# Altium schematic sheet shcmeatic_sst.SchDoc
size A4; SheetNumber: 1; SheetTotal: 1
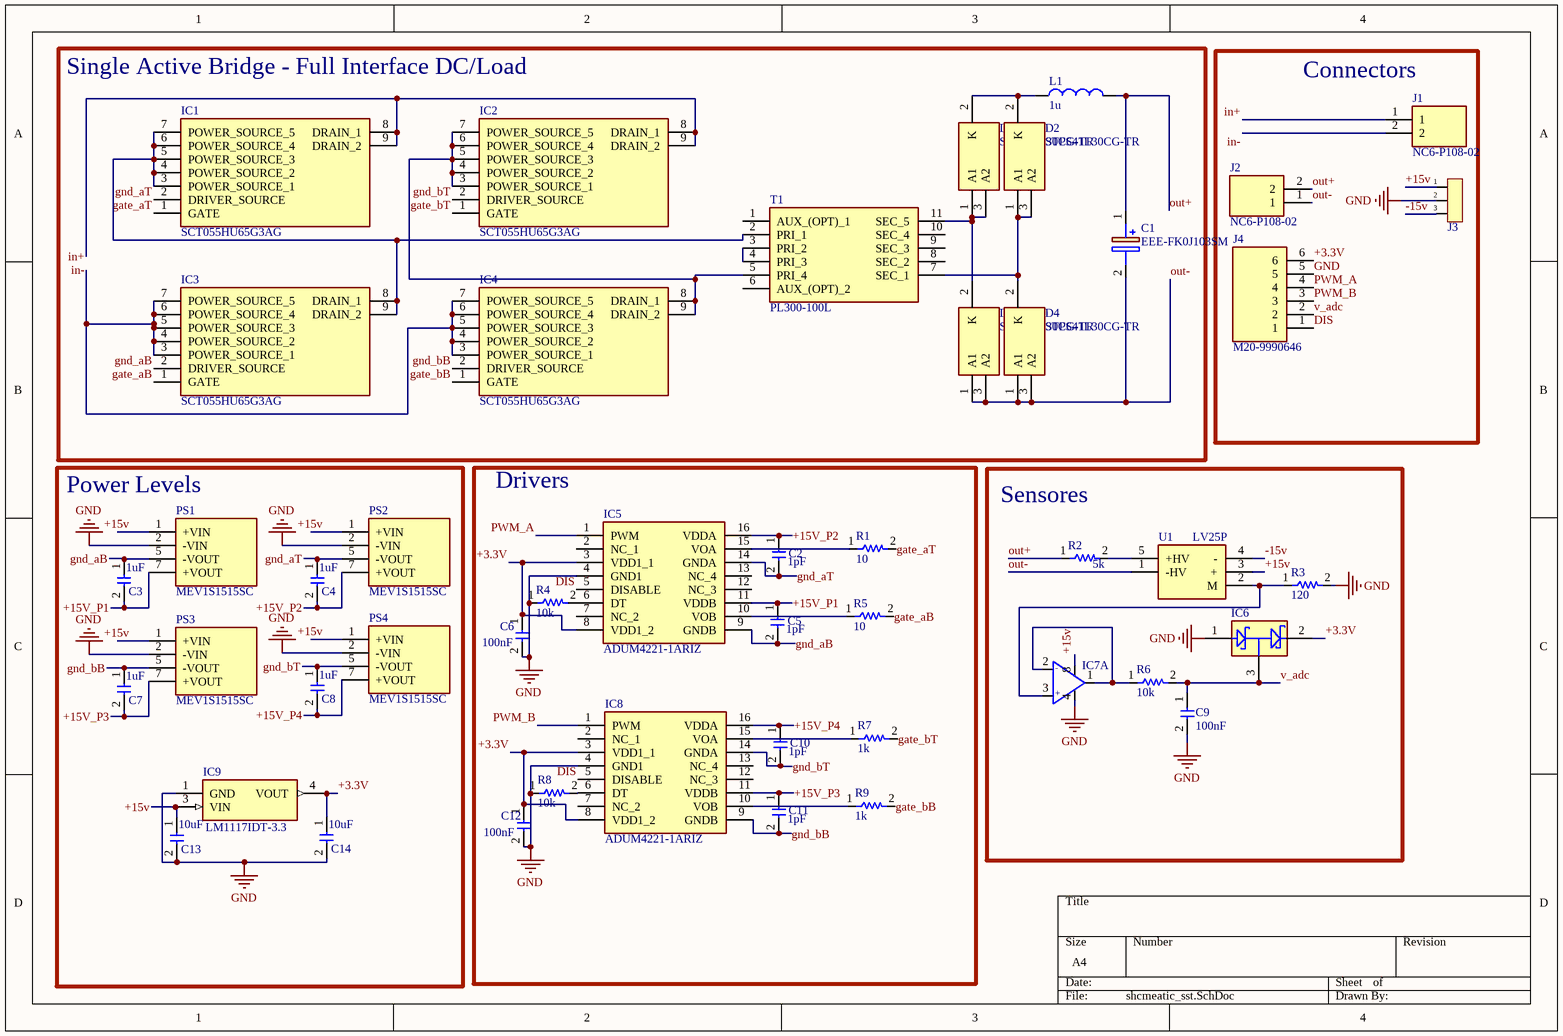
[diagram p0: shcmeatic_sst.SchDoc]

## Parts
C1  EEE-FK0J103SM  [r60_mkt_10_100_capacitor_10uF]
C2  1pF  [C1206]
C3  1uF  [C1206]
C4  1uF  [C1206]
C5  1pF  [C1206]
C6  100nF  [C1206]
C7  1uF  [C1206]
C8  1uF  [C1206]
C9  100nF  [C1206]
C10  1pF  [C1206]
C11  1pF  [C1206]
C12  100nF  [C1206]
C13  10uF  [T491C]
C14  10uF  [T491C]
D1  STPS41L30CG-TR  [STPS41L30CGTR]
D2  STPS41L30CG-TR  [STPS41L30CGTR]
D3  STPS41L30CG-TR  [STPS41L30CGTR]
D4  STPS41L30CG-TR  [STPS41L30CGTR]
IC1  SCT055HU65G3AG  [SCT055HU65G3AG]
IC2  SCT055HU65G3AG  [SCT055HU65G3AG]
IC3  SCT055HU65G3AG  [SCT055HU65G3AG]
IC4  SCT055HU65G3AG  [SCT055HU65G3AG]
IC5  ADUM4221-1ARIZ  [SOIC127P1030X264-16N]
IC6  bat54s  [BAT54S]  (value not drawn)
IC7  TSX712IDT  [SO-8]  (value not drawn)  (part A of 2)
IC8  ADUM4221-1ARIZ  [SOIC127P1030X264-16N]
IC9  LM1117IDT-3.3  [TO228P991X238-3N]
J1  NC6-P108-02  [NC6P10802]
J2  NC6-P108-02  [NC6P10802]
J3  Conector 1x3P  [Conector 1x3 Screw]  (value not drawn)
J4  M20-9990646  [HDRV6W64P0X254_1X6_1524X254X864P]
L1  value 1u  [bobine_handmade_20mm_diam]  (hidden comment: Inductor)
PS1  MEV1S1515SC  [MEV1S1515SC]
PS2  MEV1S1515SC  [MEV1S1515SC]
PS3  MEV1S1515SC  [MEV1S1515SC]
PS4  MEV1S1515SC  [MEV1S1515SC]
R1  10  [RESC3216X75N]
R2  5k  [RESC3216X75N]
R3  120  [RESC3216X75N]
R4  10k  [RESC3216X75N]
R5  10  [RESC3216X75N]
R6  10k  [RESC3216X75N]
R7  1k  [RESC3216X75N]
R8  10k  [RESC3216X75N]
R9  1k  [RESC3216X75N]
T1  PL300-100L  [PL300100L]
U1  LV25P  [LV-25-P/LV-20-P]

## Blocks framed on the sheet
Single Active Bridge - Full Interface DC/Load: C1 D1-D4 IC1-IC4 L1 T1
Connectors: J1-J4
Power Levels: C3 C4 C7 C8 C13 C14 IC9 PS1-PS4
Drivers: C2 C5 C6 C10-C12 IC5 IC8 R1 R4 R5 R7-R9
Sensores: C9 IC6 IC7 R2 R3 R6 U1

## Nets
GND: C6.2 C9.2 C12.2 C13.2 C14.2 IC5.4(GND1) IC6.1(IN) IC7.4 IC8.4(GND1) IC9.1(GND) J3.2 J4.5 PS1.2(-VIN) PS2.2(-VIN) PS3.2(-VIN) PS4.2(-VIN) R3.2 R4.1 R8.1
+3.3V: C6.1 C12.1 C14.1 IC5.3(VDD1_1) IC5.8(VDD1_2) IC6.2(OUT) IC8.3(VDD1_1) IC8.8(VDD1_2) IC9.4(VOUT) J4.6
+15v: C13.1 IC7.8 IC9.3(VIN) J3.1 PS1.1(+VIN) PS2.1(+VIN) PS3.1(+VIN) PS4.1(+VIN) U1.3(+)
+15V_P1: C3.2 C5.1 IC5.11(VDDB) PS1.7(+VOUT)
+15V_P2: C2.1 C4.2 IC5.16(VDDA) PS2.7(+VOUT)
+15V_P3: C7.2 C11.1 IC8.11(VDDB) PS3.7(+VOUT)
+15V_P4: C8.2 C10.1 IC8.16(VDDA) PS4.7(+VOUT)
-15v: J3.3 U1.4(-)
DIS: IC5.5(DISABLE) IC8.5(DISABLE) J4.1
gate_aB: IC3.1(GATE) R5.2
gate_aT: IC1.1(GATE) R1.2
gate_bB: IC4.1(GATE) R9.2
gate_bT: IC2.1(GATE) R7.2
gnd_aB: C3.1 C5.2 IC3.2(DRIVER_SOURCE) IC5.9(GNDB) PS1.5(-VOUT)
gnd_aT: C2.2 C4.1 IC1.2(DRIVER_SOURCE) IC5.14(GNDA) PS2.5(-VOUT)
gnd_bB: C7.1 C11.2 IC4.2(DRIVER_SOURCE) IC8.9(GNDB) PS3.5(-VOUT)
gnd_bT: C8.1 C10.2 IC2.2(DRIVER_SOURCE) IC8.14(GNDA) PS4.5(-VOUT)
in+: IC1.8(DRAIN_1) IC1.9(DRAIN_2) IC2.8(DRAIN_1) IC2.9(DRAIN_2) J1.1
in-: IC3.3(POWER_SOURCE_1) IC3.4(POWER_SOURCE_2) IC3.5(POWER_SOURCE_3) IC3.6(POWER_SOURCE_4) IC3.7(POWER_SOURCE_5) IC4.3(POWER_SOURCE_1) IC4.4(POWER_SOURCE_2) IC4.5(POWER_SOURCE_3) IC4.6(POWER_SOURCE_4) IC4.7(POWER_SOURCE_5) J1.2
out+: C1.1(+) J2.2 L1.2 R2.1
out-: C1.2(-) D3.1(A1) D3.3(A2) D4.1(A1) D4.3(A2) J2.1 U1.1(-HV)
PWM_A: IC5.1(PWM) J4.4
PWM_B: IC8.1(PWM) J4.3
v_adc: C9.1 IC6.3(COM) J4.2 R6.2
NetD1_1: D1.1(A1) D1.3(A2) D3.2(K) T1.11(SEC_5)
NetD1_2: D1.2(K) D2.2(K) L1.1
NetD2_1: D2.1(A1) D2.3(A2) D4.2(K) T1.7(SEC_1)
NetIC1_3: IC1.3(POWER_SOURCE_1) IC1.4(POWER_SOURCE_2) IC1.5(POWER_SOURCE_3) IC1.6(POWER_SOURCE_4) IC1.7(POWER_SOURCE_5) IC3.8(DRAIN_1) IC3.9(DRAIN_2) T1.2(PRI_1)
NetIC2_3: IC2.3(POWER_SOURCE_1) IC2.4(POWER_SOURCE_2) IC2.5(POWER_SOURCE_3) IC2.6(POWER_SOURCE_4) IC2.7(POWER_SOURCE_5) IC4.8(DRAIN_1) IC4.9(DRAIN_2) T1.5(PRI_4)
NetIC5_6: IC5.6(DT) R4.2
NetIC5_10: IC5.10(VOB) R5.1
NetIC5_15: IC5.15(VOA) R1.1
NetIC7_1: IC7.1 IC7.2 R6.1
NetIC7_3: IC7.3 R3.1 U1.2(M)
NetIC8_6: IC8.6(DT) R8.2
NetIC8_10: IC8.10(VOB) R9.1
NetIC8_15: IC8.15(VOA) R7.1
NetR2_2: R2.2 U1.5(+HV)
NetT1_3: T1.3(PRI_2) T1.4(PRI_3)

Not connected (* = marked no-connect by the designer): IC5 2(NC_1) 7(NC_2) 12(NC_3) 13(NC_4); IC8 2(NC_1) 7(NC_2) 12(NC_3) 13(NC_4); T1 1(AUX_(OPT)_1) 6(AUX_(OPT)_2) 8(SEC_2) 9(SEC_3) 10(SEC_4)

## Notes on the sheet
- Decoupling capacitors for sensors supply, must be as close as possible to the pins
- (in symbol TSX712IDT, part A) -; +

## Library data of the parts
C1 = EEE-FK0J103SM: Capacitor Polarised; Manufacturer_Name: Panasonic; Datasheet Link: http://industrial.panasonic.com/cdbs/www-data/pdf/RDE0000/ABA0000C1247.pdf; Height: 17mm; Manufacturer_Part_Number: EEE-FK0J103SM; Mouser Part Number: 667-EEE-FK0J103SM; Mouser Price/Stock: https://www.mouser.co.uk/ProductDetail/Panasonic/EEE-FK0J103SM?qs=BZBei1rCqCBAIuPdads%2FBA%3D%3D; Arrow Part Number: EEE-FK0J103SM; Arrow Price/Stock: https://www.arrow.com/en/products/eee-fk0j103sm/panasonic?region=nac
C2-C12 = Capacitor
C13 = Capacitor: tantalum
C14 = Capacitor: Tantalum
D1-D4 = STPS41L30CG-TR: Schottky Diode; Manufacturer_Name: STMicroelectronics; Datasheet Link: https://componentsearchengine.com/Datasheets/2/STPS41L30CG-TR.pdf; Height: 4.6mm; Manufacturer_Part_Number: STPS41L30CG-TR; Mouser Part Number: 511-STPS41L30CG-TR; Mouser Price/Stock: https://www.mouser.co.uk/ProductDetail/STMicroelectronics/STPS41L30CG-TR?qs=jc1eLQFRxDHV9yBTVSfaIA%3D%3D; Arrow Part Number: STPS41L30CG-TR; Arrow Price/Stock: https://www.arrow.com/en/products/stps41l30cg-tr/stmicroelectronics?region=nac
IC1-IC4 = SCT055HU65G3AG: Integrated Circuit; Manufacturer_Name: STMicroelectronics; Datasheet Link: https://www.st.com/resource/en/datasheet/sct055hu65g3ag.pdf; Manufacturer_Part_Number: SCT055HU65G3AG; Mouser Part Number: 511-SCT055HU65G3AG; Mouser Price/Stock: https://www.mouser.co.uk/ProductDetail/STMicroelectronics/SCT055HU65G3AG?qs=amGC7iS6iy%252BmvA31UWzWZg%3D%3D
IC5 IC8 = ADUM4221-1ARIZ: Integrated Circuit; Manufacturer_Name: Analog Devices; Datasheet Link: https://www.mouser.com/datasheet/2/609/adum4221_adum4221_1-1901725.pdf; Height: 2.64mm; Manufacturer_Part_Number: ADUM4221-1ARIZ; Mouser Part Number: 584-ADUM4221-1ARIZ; Mouser Price/Stock: https://www.mouser.co.uk/ProductDetail/Analog-Devices/ADUM4221-1ARIZ?qs=DPoM0jnrROU7HCm%2F%252BdCvpQ%3D%3D; Arrow Part Number: ADUM4221-1ARIZ; Arrow Price/Stock: https://www.arrow.com/en/products/adum4221-1ariz/analog-devices?region=nac
IC9 = LM1117IDT-3.3: Integrated Circuit; Manufacturer_Name: Texas Instruments; Datasheet Link: https://datasheet.datasheetarchive.com/originals/distributors/SFDatasheet-3/sf-00077938.pdf; Height: 2.38mm; Manufacturer_Part_Number: LM1117IDT-3.3; Mouser Part Number: 926-LM1117IDT-33; Mouser Price/Stock: https://www.mouser.co.uk/ProductDetail/Texas-Instruments/LM1117IDT-33?qs=X1J7HmVL2ZH2wA5IJrsANw%3D%3D
J1 J2 = NC6-P108-02: Connector; Manufacturer_Name: TE Connectivity; Datasheet Link: https://www.te.com/commerce/DocumentDelivery/DDEController?Action=srchrtrv&DocNm=1-1773458-2_BARRIER_STRIPS_QRG&DocType=Data%20Sheet&DocLang=English&PartCntxt=3-1437664-0&DocFormat=pdf; Height: 16.764mm; Manufacturer_Part_Number: NC6-P108-02; Mouser Part Number: 571-314376640; Mouser Price/Stock: https://www.mouser.co.uk/ProductDetail/TE-Connectivity/NC6-P108-02?qs=eaV0Ah4wSgl6VCGwzfbTcQ%3D%3D; Arrow Part Number: NC6-P108-02; Arrow Price/Stock: https://www.arrow.com/en/products/nc6-p108-02/te-connectivity?region=nac
J4 = M20-9990646: Connector; Manufacturer_Name: Harwin; Datasheet Link: https://cdn.harwin.com/pdfs/M20-999.pdf; Height: 8.64mm; Manufacturer_Part_Number: M20-9990646; Mouser Part Number: 855-M20-9990646; Mouser Price/Stock: https://www.mouser.co.uk/ProductDetail/Harwin/M20-9990646?qs=Jph8NoUxIfXDcWZbabSSiw%3D%3D
L1 = Inductor: SimulationGenericComponent: True
PS1-PS4 = MEV1S1515SC: Power Supply; Manufacturer_Name: Murata Electronics; Datasheet Link: https://power.murata.com/data/power/ncl/kdc_mev.pdf; Height: 10.15mm; Manufacturer_Part_Number: MEV1S1515SC; Mouser Part Number: 580-MEV1S1515SC; Mouser Price/Stock: https://www.mouser.co.uk/ProductDetail/Murata-Power-Solutions/MEV1S1515SC?qs=ElE%2F8fqQeYgmd421%2FET8wA%3D%3D; Arrow Part Number: MEV1S1515SC; Arrow Price/Stock: https://www.arrow.com/en/products/mev1s1515sc/murata-power-solutions?region=nac
R1 R4-R9 = Resistor
R2 = Resistor: 140 mW
R3 = Resistor: 82.5 mW
T1 = PL300-100L: Transformer; Manufacturer_Name: COILCRAFT; Datasheet Link: https://componentsearchengine.com/Datasheets/2/PL300-100L.pdf; Height: 10.4mm; Manufacturer_Part_Number: PL300-100L; Mouser Part Number: 994-PL300-100L; Mouser Price/Stock: https://www.mouser.co.uk/ProductDetail/Coilcraft/PL300-100L?qs=W38ilblRkRl%252BXAXYuhUadw%3D%3D
U1 = LV25P: Undefined or Miscellaneous; Manufacturer_Name: LEM; Manufacturer_Part_Number: LV25P